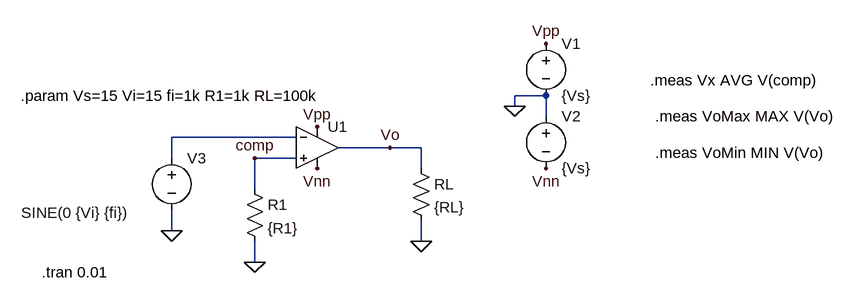
[diagram p0: schematic Comp00.asc]
Comp00.asc, the LTspice schematic file:
Version 4
SHEET 1 968 680
WIRE 512 144 464 144
WIRE 464 160 464 144
WIRE 512 176 512 144
WIRE 128 208 -64 208
WIRE 272 224 192 224
WIRE 320 224 272 224
WIRE -64 240 -64 208
WIRE 128 240 64 240
WIRE 320 256 320 224
WIRE 64 288 64 240
WIRE -64 352 -64 320
WIRE 320 368 320 336
WIRE 64 400 64 368
FLAG 512 64 Vpp
FLAG 464 160 0
FLAG 512 256 Vnn
FLAG 320 368 0
FLAG 64 400 0
FLAG 272 224 Vo
FLAG -64 352 0
FLAG 160 192 Vpp
FLAG 160 256 Vnn
FLAG 64 240 comp
SYMBOL voltage 512 48 R0
WINDOW 123 0 0 Left 0
WINDOW 39 0 0 Left 0
SYMATTR InstName V1
SYMATTR Value {Vs}
SYMBOL voltage 512 160 R0
WINDOW 123 0 0 Left 0
WINDOW 39 0 0 Left 0
SYMATTR InstName V2
SYMATTR Value {Vs}
SYMBOL res 304 240 R0
SYMATTR InstName RL
SYMATTR Value {RL}
SYMBOL res 48 272 R0
SYMATTR InstName R1
SYMATTR Value {R1}
SYMBOL voltage -64 224 R0
WINDOW 3 -231 100 Left 2
WINDOW 123 0 0 Left 0
WINDOW 39 0 0 Left 0
SYMATTR Value SINE(0 {Vi} {fi})
SYMATTR InstName V3
SYMBOL Opamps\\UniversalOpamp2 160 224 R0
SYMATTR InstName U1
TEXT -296 144 Left 2 !.param Vs=15 Vi=15 fi=1k R1=1k RL=100k
TEXT -264 416 Left 2 !.tran 0.01
TEXT 672 120 Left 2 !.meas Vx AVG V(comp)
TEXT 680 176 Left 2 !.meas VoMax MAX V(Vo)
TEXT 680 232 Left 2 !.meas VoMin MIN V(Vo)

The netlist it stands for:
* Comp00.asc
V1 Vpp 0 {Vs}
V2 0 Vnn {Vs}
RL Vo 0 {RL}
R1 comp 0 {R1}
V3 N001 0 SINE(0 {Vi} {fi})
XU1 comp N001 Vpp Vnn Vo level.2 Avol=1Meg GBW=10Meg Slew=10Meg ilimit=25m rail=0 Vos=0 phimargin=45 en=0 enk=0 in=0 ink=0 Rin=500Meg  ; pins IN+ IN- V+ V- OUT
.param Vs=15 Vi=15 fi=1k R1=1k RL=100k
.tran 0.01
.meas Vx AVG V(comp)
.meas VoMax MAX V(Vo)
.meas VoMin MIN V(Vo)
.lib UniversalOpamps2.sub
.backanno
.end